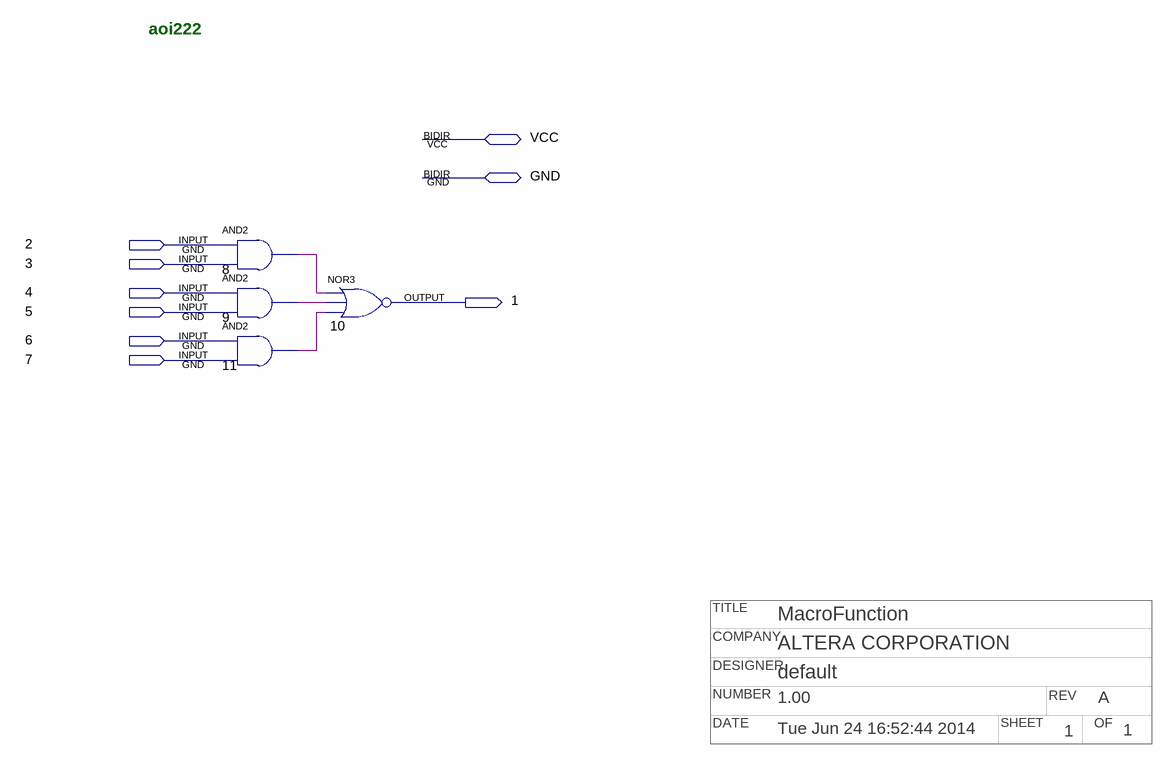
[diagram p0: schematic sheet]
// Quartus schematic npaoi222.bdf as structural Verilog: 4 symbols, 9 pins
// Title block: TITLE: MacroFunction; COMPANY: ALTERA CORPORATION; DESIGNER: default; NUMBER: 1.00; REV: A; DATE: Tue Jun 24 16:52:44 2014; SHEET: 1; OF: 1
module npaoi222 (
  input  \2 ,
  input  \3 ,
  input  \4 ,
  input  \5 ,
  input  \6 ,
  input  \7 ,
  inout  VCC,
  inout  GND,
  output \1 
);

  wire n8_out, n9_out, n11_out;

  and u_8 (n8_out, \2 , \3 );
  and u_9 (n9_out, \4 , \5 );
  and u_11 (n11_out, \6 , \7 );
  nor u_10 (\1 , n8_out, n9_out, n11_out);

  // Notes on the sheet:
  //   aoi222
endmodule
